# Altium schematic sheet MCU.SchDoc
size A3
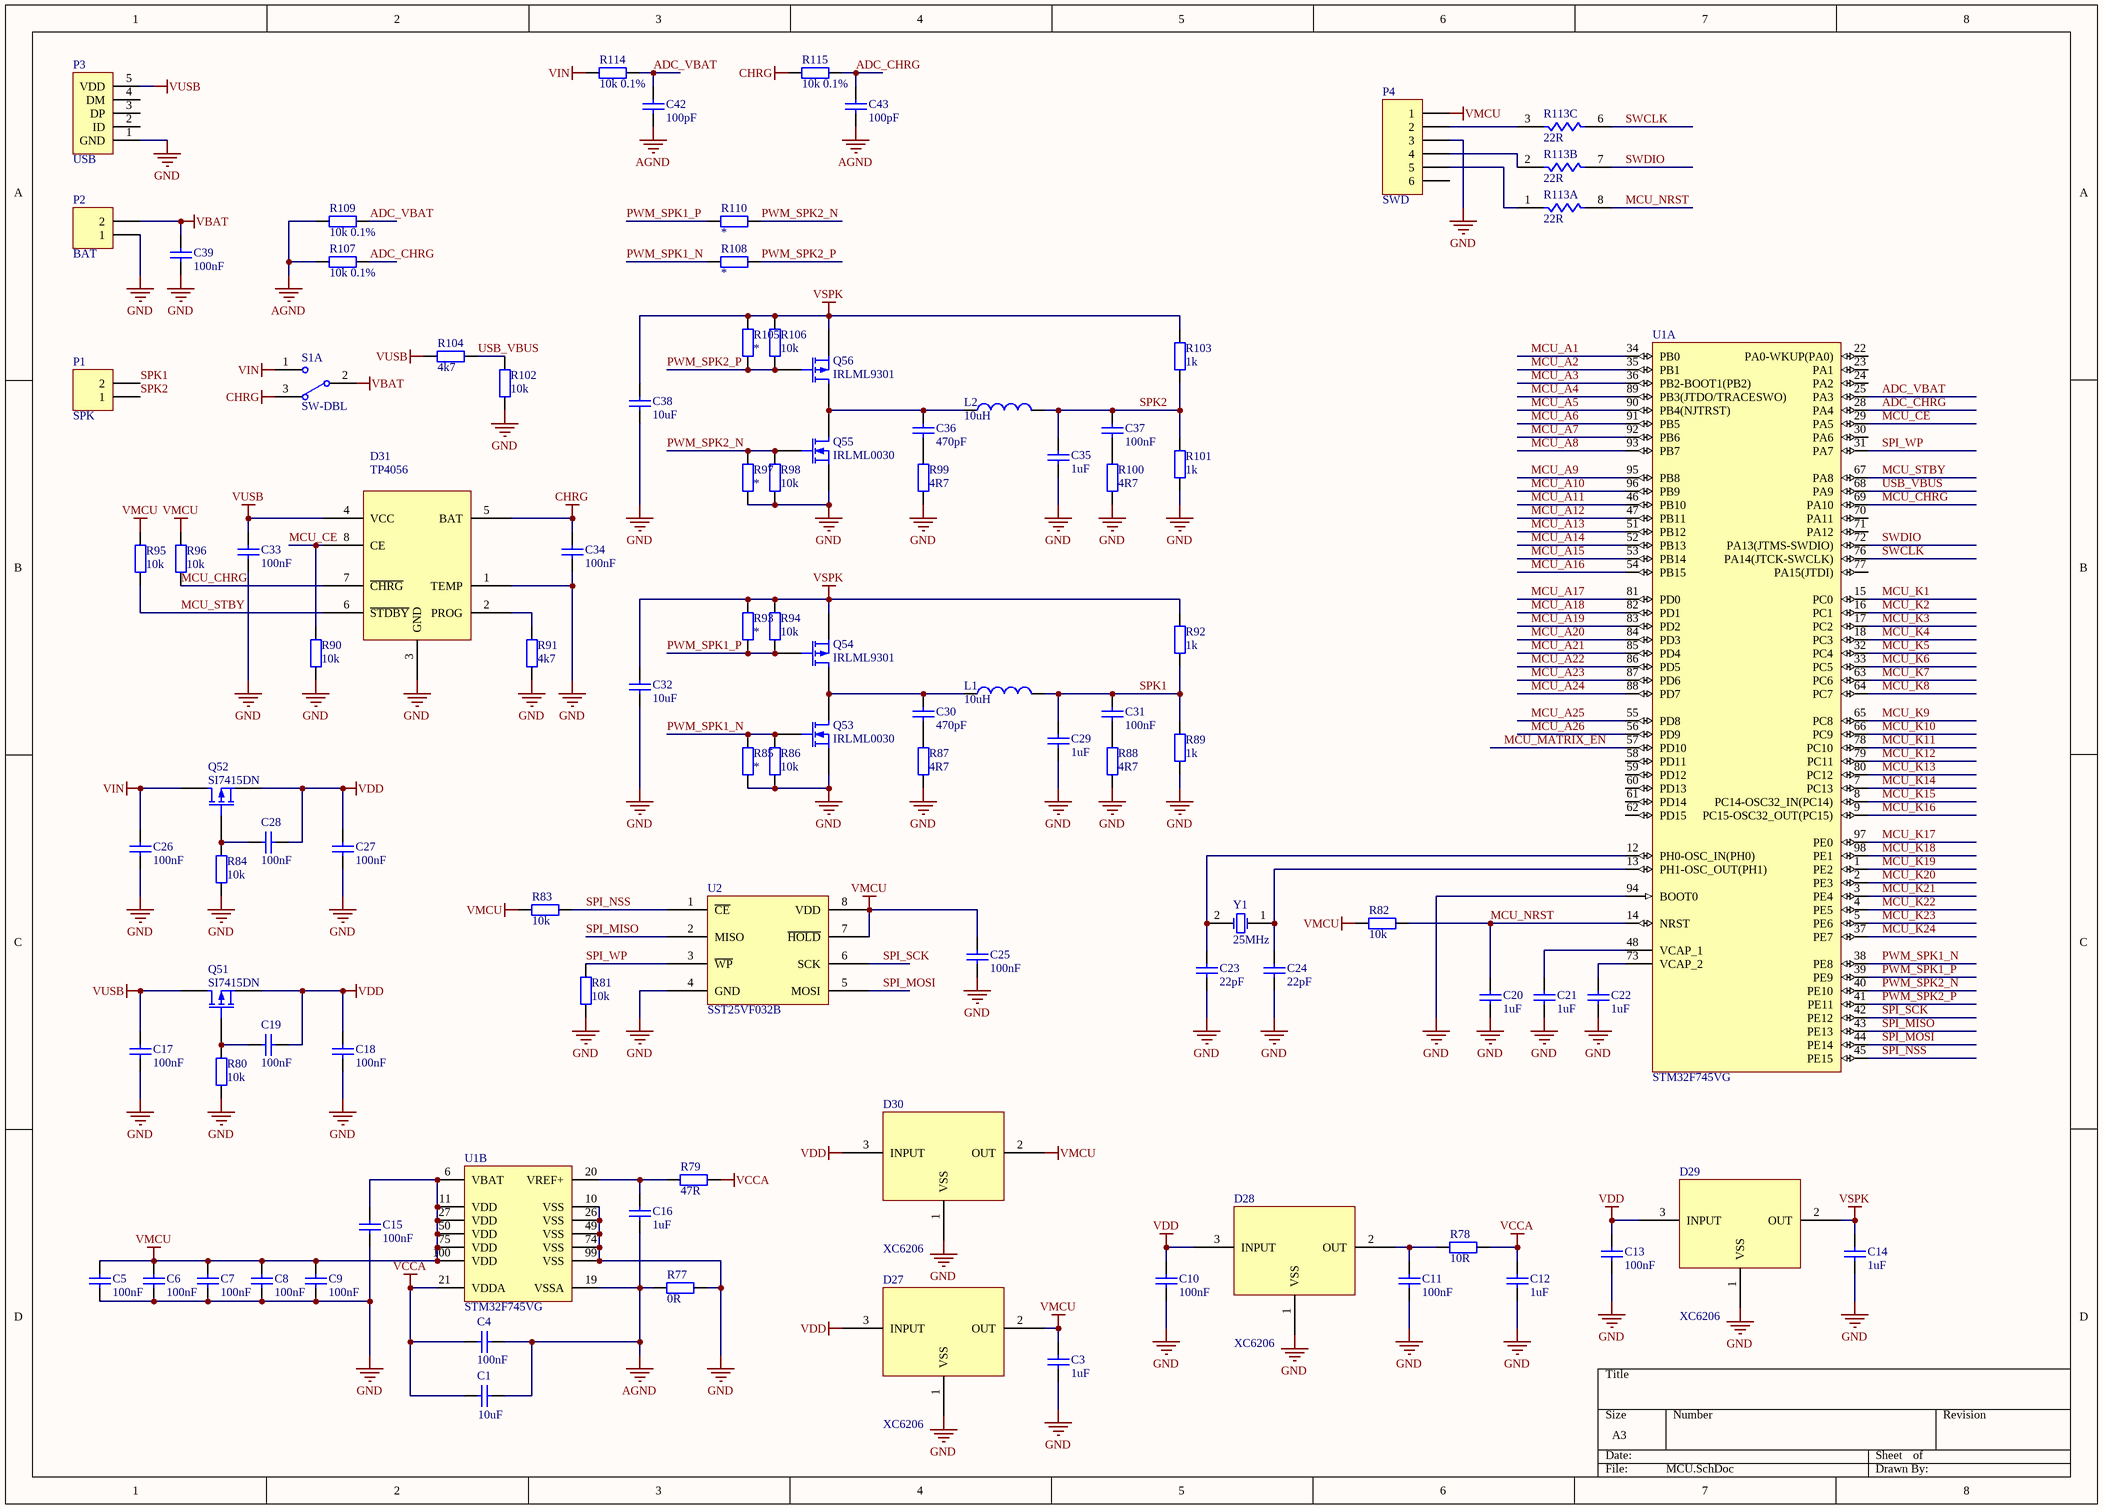
[diagram p0: MCU.SchDoc]

## Parts
C1  value 10uF  [c1206]  (hidden comment: Cap)
C3  value 1uF  [C0603]  (hidden comment: Cap)
C4  value 100nF  [C0603]  (hidden comment: Cap)
C5  value 100nF  [C0603]  (hidden comment: Cap)
C6  value 100nF  [C0603]  (hidden comment: Cap)
C7  value 100nF  [C0603]  (hidden comment: Cap)
C8  value 100nF  [C0603]  (hidden comment: Cap)
C9  value 100nF  [C0603]  (hidden comment: Cap)
C10  value 100nF  [C0603]  (hidden comment: Cap)
C11  value 100nF  [C0603]  (hidden comment: Cap)
C12  value 1uF  [C0603]  (hidden comment: Cap)
C13  value 100nF  [C0603]  (hidden comment: Cap)
C14  value 1uF  [C0603]  (hidden comment: Cap)
C15  value 100nF  [C0603]  (hidden comment: Cap)
C16  value 1uF  [C0603]  (hidden comment: Cap)
C17  value 100nF  [C0603]  (hidden comment: Cap)
C18  value 100nF  [C0603]  (hidden comment: Cap)
C19  value 100nF  [C0603]  (hidden comment: Cap)
C20  value 1uF  [C0603]  (hidden comment: Cap)
C21  value 1uF  [C0603]  (hidden comment: Cap)
C22  value 1uF  [C0603]  (hidden comment: Cap)
C23  value 22pF  [c0603]
C24  value 22pF  [c0603]
C25  value 100nF  [C0603]  (hidden comment: Cap)
C26  value 100nF  [C0603]  (hidden comment: Cap)
C27  value 100nF  [C0603]  (hidden comment: Cap)
C28  value 100nF  [C0603]  (hidden comment: Cap)
C29  value 1uF  [C0603]  (hidden comment: Cap)
C30  value 470pF  [C0603]  (hidden comment: Cap)
C31  value 100nF  [C0603]  (hidden comment: Cap)
C32  value 10uF  [c1206]  (hidden comment: Cap)
C33  value 100nF  [C0603]  (hidden comment: Cap)
C34  value 100nF  [C0603]  (hidden comment: Cap)
C35  value 1uF  [C0603]  (hidden comment: Cap)
C36  value 470pF  [C0603]  (hidden comment: Cap)
C37  value 100nF  [C0603]  (hidden comment: Cap)
C38  value 10uF  [c1206]  (hidden comment: Cap)
C39  value 100nF  [C0603]  (hidden comment: Cap)
C42  value 100pF  [C0603]  (hidden comment: Cap)
C43  value 100pF  [C0603]  (hidden comment: Cap)
D27  XC6206  [sot23]
D28  XC6206  [sot23]
D29  XC6206  [sot23]
D30  XC6206  [sot23]
D31  TP4056  [SO8_WPAD]
L1  value 10uH  [CD32_Inductor]
L2  value 10uH  [CD32_Inductor]
P1  SPK  [HDR1X2]
P2  BAT  [HDR1X2]
P3  USB  [MICRO_USB]
P4  SWD  [HDR1X6]
Q51  SI7415DN  [PowerPAK1212-8]
Q52  SI7415DN  [PowerPAK1212-8]
Q53  IRLML0030  [sot23]
Q54  IRLML9301  [sot23]
Q55  IRLML0030  [sot23]
Q56  IRLML9301  [sot23]
R77  value 0R  [r0603]  (hidden comment: Resistor)
R78  value 10R  [r0603]  (hidden comment: Resistor)
R79  value 47R  [r0603]  (hidden comment: Resistor)
R80  value 10k  [r0603]  (hidden comment: Resistor)
R81  value 10k  [r0603]  (hidden comment: Resistor)
R82  value 10k  [r0603]  (hidden comment: Resistor)
R83  value 10k  [r0603]  (hidden comment: Resistor)
R84  value 10k  [r0603]  (hidden comment: Resistor)
R85  Resistor  [n0603]  (value not drawn)
R86  value 10k  [r0603]  (hidden comment: Resistor)
R87  value 4R7  [r0603]  (hidden comment: Resistor)
R88  value 4R7  [r0603]  (hidden comment: Resistor)
R89  value 1k  [r0603]  (hidden comment: Resistor)
R90  value 10k  [r0603]  (hidden comment: Resistor)
R91  value 4k7  [r0603]  (hidden comment: Resistor)
R92  value 1k  [r0603]  (hidden comment: Resistor)
R93  Resistor  [n0603]  (value not drawn)
R94  value 10k  [r0603]  (hidden comment: Resistor)
R95  value 10k  [r0603]  (hidden comment: Resistor)
R96  value 10k  [r0603]  (hidden comment: Resistor)
R97  Resistor  [n0603]  (value not drawn)
R98  value 10k  [r0603]  (hidden comment: Resistor)
R99  value 4R7  [r0603]  (hidden comment: Resistor)
R100  value 4R7  [r0603]  (hidden comment: Resistor)
R101  value 1k  [r0603]  (hidden comment: Resistor)
R102  value 10k  [r0603]  (hidden comment: Resistor)
R103  value 1k  [r0603]  (hidden comment: Resistor)
R104  value 4k7  [r0603]  (hidden comment: Resistor)
R105  Resistor  [n0603]  (value not drawn)
R106  value 10k  [r0603]  (hidden comment: Resistor)
R107  value 10k 0.1%  [r0603]  (hidden comment: Resistor)
R108  Resistor  [n0603]  (value not drawn)
R109  value 10k 0.1%  [r0603]  (hidden comment: Resistor)
R110  Resistor  [n0603]  (value not drawn)
R113  value 22R  [R1206_PACK]  (hidden comment: Res Pack 1206)  (parts A,B,C of 4)
R114  value 10k 0.1%  [r0603]  (hidden comment: Resistor)
R115  value 10k 0.1%  [r0603]  (hidden comment: Resistor)
S1  SW-DBL  [SK-22D07VG5]  (part A of 2)
U1  STM32F745VG  [lqfp100_m]  (parts A,B of 2)
U2  SST25VF032B  [SO8_25EE]
Y1  25MHz  [KX-7]

## Nets
AGND: C1.2 C4.2 C16.1 C42.1 C43.1 R77.1 R107.2 R109.2 U1.19(VSSA)
CHRG: C34.2 D31.5(BAT) R115.2 S1.3
GND: C3.1 C5.1 C6.1 C7.1 C8.1 C9.1 C10.1 C11.1 C12.1 C13.1 C14.1 C15.1 C17.1 C18.1 C20.1 C21.1 C22.1 C23.2 C24.2 C25.1 C26.1 C27.1 C29.1 C32.1 C33.1 C34.1 C35.1 C38.1 C39.1 D27.1(VSS) D28.1(VSS) D29.1(VSS) D30.1(VSS) D31.1(TEMP) D31.3(GND) P2.1 P3.1(GND) P4.3 Q53.2(S) Q55.2(S) R77.2 R80.1 R81.1 R84.1 R85.1 R86.1 R87.1 R88.1 R89.1 R90.1 R91.1 R97.1 R98.1 R99.1 R100.1 R101.1 R102.2 U1.10(VSS) U1.26(VSS) U1.49(VSS) U1.74(VSS) U1.94(BOOT0) U1.99(VSS) U2.4(GND)
VBAT: C39.2 P2.2 S1.2
VCCA: C1.1 C4.1 C12.2 R78.2 R79.2 U1.21(VDDA)
VDD: C10.2 C13.2 C18.2 C19.1 C27.2 C28.1 D27.3(INPUT) D28.3(INPUT) D29.3(INPUT) D30.3(INPUT) Q51.2(S) Q52.2(S)
VIN: C26.2 Q52.3(D) R114.2 S1.1
VMCU: C3.2 C5.2 C6.2 C7.2 C8.2 C9.2 C15.2 C25.2 D27.2(OUT) D30.2(OUT) P4.1 R82.1 R83.1 R95.2 R96.2 U1.6(VBAT) U1.11(VDD) U1.27(VDD) U1.50(VDD) U1.75(VDD) U1.100(VDD) U2.7(~{HOLD}) U2.8(VDD)
VSPK: C14.2 C32.2 C38.2 D29.2(OUT) Q54.2(S) Q56.2(S) R92.2 R93.2 R94.2 R103.2 R105.2 R106.2
VUSB: C17.2 C33.2 D31.4(VCC) P3.5(VDD) Q51.3(D) R104.2
ADC_CHRG: C43.2 R107.1 R115.1 U1.28(PA4)
ADC_VBAT: C42.2 R109.1 R114.1 U1.25(PA3)
MCU_A1: U1.34(PB0)
MCU_A2: U1.35(PB1)
MCU_A3: U1.36(PB2-BOOT1(PB2))
MCU_A4: U1.89(PB3(JTDO/TRACESWO))
MCU_A5: U1.90(PB4(NJTRST))
MCU_A6: U1.91(PB5)
MCU_A7: U1.92(PB6)
MCU_A8: U1.93(PB7)
MCU_A9: U1.95(PB8)
MCU_A10: U1.96(PB9)
MCU_A11: U1.46(PB10)
MCU_A12: U1.47(PB11)
MCU_A13: U1.51(PB12)
MCU_A14: U1.52(PB13)
MCU_A15: U1.53(PB14)
MCU_A16: U1.54(PB15)
MCU_A17: U1.81(PD0)
MCU_A18: U1.82(PD1)
MCU_A19: U1.83(PD2)
MCU_A20: U1.84(PD3)
MCU_A21: U1.85(PD4)
MCU_A22: U1.86(PD5)
MCU_A23: U1.87(PD6)
MCU_A24: U1.88(PD7)
MCU_A25: U1.55(PD8)
MCU_A26: U1.56(PD9)
MCU_CE: D31.8(CE) R90.2 U1.29(PA5)
MCU_CHRG: D31.7(~{CHRG}) R96.1 U1.69(PA10)
MCU_K1: U1.15(PC0)
MCU_K2: U1.16(PC1)
MCU_K3: U1.17(PC2)
MCU_K4: U1.18(PC3)
MCU_K5: U1.32(PC4)
MCU_K6: U1.33(PC5)
MCU_K7: U1.63(PC6)
MCU_K8: U1.64(PC7)
MCU_K9: U1.65(PC8)
MCU_K10: U1.66(PC9)
MCU_K11: U1.78(PC10)
MCU_K12: U1.79(PC11)
MCU_K13: U1.80(PC12)
MCU_K14: U1.7(PC13)
MCU_K15: U1.8(PC14-OSC32_IN(PC14))
MCU_K16: U1.9(PC15-OSC32_OUT(PC15))
MCU_K17: U1.97(PE0)
MCU_K18: U1.98(PE1)
MCU_K19: U1.1(PE2)
MCU_K20: U1.2(PE3)
MCU_K21: U1.3(PE4)
MCU_K22: U1.4(PE5)
MCU_K23: U1.5(PE6)
MCU_K24: U1.37(PE7)
MCU_MATRIX_EN: U1.57(PD10)
MCU_NRST: C20.2 R82.2 R113.8 U1.14(NRST)
MCU_STBY: D31.6(~{STDBY}) R95.1 U1.67(PA8)
PWM_SPK1_N: Q53.1(G) R85.2 R86.2 R108.2 U1.38(PE8)
PWM_SPK1_P: Q54.1(G) R93.1 R94.1 R110.2 U1.39(PE9)
PWM_SPK2_N: Q55.1(G) R97.2 R98.2 R110.1 U1.40(PE10)
PWM_SPK2_P: Q56.1(G) R105.1 R106.1 R108.1 U1.41(PE11)
SPI_MISO: U1.43(PE13) U2.2(MISO)
SPI_MOSI: U1.44(PE14) U2.5(MOSI)
SPI_NSS: R83.2 U1.45(PE15) U2.1(~{CE})
SPI_SCK: U1.42(PE12) U2.6(SCK)
SPI_WP: R81.2 U1.31(PA7) U2.3(~{WP})
SPK1: C29.2 C31.2 L1.2 P1.2 R89.2 R92.1
SPK2: C35.2 C37.2 L2.2 P1.1 R101.2 R103.1
SWCLK: R113.6 U1.76(PA14(JTCK-SWCLK))
SWDIO: R113.7 U1.72(PA13(JTMS-SWDIO))
USB_VBUS: R102.1 R104.1 U1.68(PA9)
NetC11_2: C11.2 D28.2(OUT) R78.1
NetC16_2: C16.2 R79.1 U1.20(VREF+)
NetC19_2: C19.2 Q51.1(G) R80.2
NetC21_2: C21.2 U1.48(VCAP_1)
NetC22_2: C22.2 U1.73(VCAP_2)
NetC23_1: C23.1 U1.12(PH0-OSC_IN(PH0)) Y1.2(OSC2)
NetC24_1: C24.1 U1.13(PH1-OSC_OUT(PH1)) Y1.1(OSC1)
NetC28_2: C28.2 Q52.1(G) R84.2
NetC30_1: C30.1 R87.2
NetC30_2: C30.2 L1.1 Q53.3(D) Q54.3(D)
NetC31_1: C31.1 R88.2
NetC36_1: C36.1 R99.2
NetC36_2: C36.2 L2.1 Q55.3(D) Q56.3(D)
NetC37_1: C37.1 R100.2
NetD31_2: D31.2(PROG) R91.2
NetP4_2: P4.2 R113.3
NetP4_4: P4.4 R113.2
NetP4_5: P4.5 R113.1

Not connected (* = marked no-connect by the designer): P3 2(ID) 3(DP) 4(DM); P4 6; U1 22(PA0-WKUP(PA0)) 23(PA1) 24(PA2) 30(PA6) 58(PD11) 59(PD12) 60(PD13) 61(PD14) 62(PD15) 70(PA11) 71(PA12) 77(PA15(JTDI))

## Library data of the parts
C1 C3-C39 C42 C43 = Cap: Capacitor; Published: 8-Jun-2000; LatestRevisionDate: 17-Jul-2002; LatestRevisionNote: Re-released for DXP Platform.; PackageReference: RAD-0.3; Publisher: Altium Limited; PackageDescription: Radial Cap, Thru-Hole; 2 Leads; 0.3 in Pin Spacing
L1 L2 = Inductor: Code_IEC: 1005; Published: 8-Jun-2000; LatestRevisionDate: 29-May-2009; LatestRevisionNote: IPC-7351 Footprint Added.; PackageReference: 0402-A; Publisher: Altium Limited; PackageDescription: Chip Inductor; Code_JEITA: 0402
P1 P2 = Header 2: Header, 2-Pin; LatestRevisionDate: 17-Jul-2002; LatestRevisionNote: Re-released for DXP Platform.; Publisher: Altium Limited
P3 = USB: Header, 5-Pin; LatestRevisionDate: 17-Jul-2002; LatestRevisionNote: Re-released for DXP Platform.; Publisher: Altium Limited
P4 = Header 6: Header, 6-Pin; LatestRevisionDate: 17-Jul-2002; LatestRevisionNote: Re-released for DXP Platform.; Publisher: Altium Limited
Q51 Q52 Q54 Q56 = MOSFET-P: P-Channel MOSFET; Published: 8-Jun-2000; LatestRevisionDate: 17-Jul-2002; LatestRevisionNote: Re-released for DXP Platform.; PackageVersion: 1995/1996; PackageReference: E3; Publisher: Altium Limited; PackageDescription: TO, Flat Index; 3 In-Line, Axial Leads; Body Dia. 4.6mm; Lead Dia. 0.5 mm (max)
Q53 Q55 = MOSFET-N: N-Channel MOSFET; Published: 8-Jun-2000; LatestRevisionDate: 17-Jul-2002; LatestRevisionNote: Re-released for DXP Platform.; PackageVersion: 1995/1996; PackageReference: E3; Publisher: Altium Limited; PackageDescription: TO, Flat Index; 3 In-Line, Axial Leads; Body Dia. 4.6mm; Lead Dia. 0.5 mm (max)
R113 = Res Pack 1206: Isolated Resistor Network - Parts; Sim Note: Enter the Resistance value into parameter field.; Published: 24-Mar-1999; LatestRevisionDate: 29-May-2009; LatestRevisionNote: IPC-7351 Footprint Added.; PackageReference: SOIC16; Publisher: Altium Limited; PackageDescription: 16-Pin Small Outline Integrated Circuit 1.27 mm Pitch; Code_JEDEC: MS-012-AC; Code_IPC: SOIC127P600-16
S1 = SW-DBL: SPDT Subminiature Toggle Switch, Right Angle Mounting, Vertical Actuation; Published: 24-Mar-1999; LatestRevisionDate: 17-Dec-2003; LatestRevisionNote: Schematic revised, PCB Footprint replaced.; DatasheetVersion: 05-Dec-2000; PackageReference: TL36WW15050; Publisher: Altium Limited; PackageDescription: Switch; 4 Leads; ComponentLink1Description: Manufacturer Link; ComponentLink1URL: http://www.apem.com
U1 = STM32F746VG: ARM Cortex-M4 32-bit MCU+FPU, 210 DMIPS, 1024 kB Flash, 192 kB Internal RAM, 82 I/Os, 100-pin LQFP, -40 to 85 degC, Tray; Manufacturer: STMicroelectronics; PartNumber: STM32F407VGT6; D/A Converter: 2x12-bit; FLASH Size (Prog) (kB): 1024; I/Os (High Current): 82; Internal RAM Size (kB): 192; Operating Frequency(F) (Processor speed) (MHz): 168; Supply Voltage(Vcc) max (V): 3.6; Supply Voltage(Vcc) min (V): 1.8; DatasheetVersion: Rev. 4; PackageVersion: Rev. 1, 06/2013; PackageReference: LQFP100; PackageDescription: 100-Pin Low Profile Quad Flat Package, 14 x 14 mm Body, 0.5 mm Pitch; Supplier 1: Digi-Key; Supplier Part Number 1: 497-11605-ND; Supplier 2: Farnell; Supplier Part Number 2: 2064368; Supplier 3: Newark; Supplier Part Number 3: 73T2333; Supplier 4: Mouser; Supplier Part Number 4: 511-STM32F407VGT6; Core: ARM Cortex-M4; Packing: Tray; Mounting Technology: Surface Mount; ComponentLink1Description: Manufacturer URL; ComponentLink1URL: http://www.st.com/web/en/home.html; ComponentLink2Description: Datasheet; ComponentLink2URL: http://www.st.com/st-web-ui/static/active/en/resource/technical/document/datasheet/DM00037051.pdf; ComponentLink3Description: Package Specification; ComponentLink3URL: http://www.st.com/st-web-ui/static/active/en/resource/technical/document/data_brief/DM00071938.pdf
U2 = EEPROM_SPI
Y1 = XTAL_4pin: Crystal Oscillator; Published: 8-Jun-2000; LatestRevisionDate: 17-Jul-2002; LatestRevisionNote: Re-released for DXP Platform.; PackageReference: R38; Publisher: Altium Limited; PackageDescription: Crystal, Thru-Hole; 2 Leads; Body 3.1 x 8.2 mm (Dia.xH)
R77-R110 R114 R115 = Resistor: Published: 8-Jun-2000; LatestRevisionDate: 17-Jul-2002; LatestRevisionNote: Re-released for DXP Platform.; PackageReference: AXIAL-0.4; Publisher: Altium Limited; PackageDescription: Axial Device, Thru-Hole; 2 Leads; 0.4 in Pin Spacing
  R85 R93 R97 R105 R108 R110: Value: *